# Altium schematic sheet Sch_Dr_LC .SchDoc
size A4; Organization: Altium Limited; Address1: L3, 12a Rodborough Rd; Address2: Frenchs Forest; Address3: NSW; Address4: Australia 2086
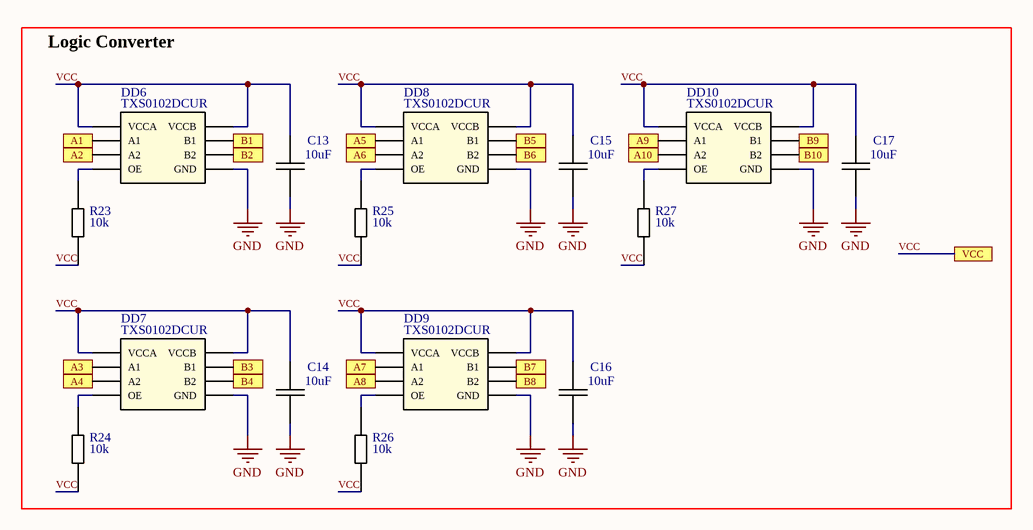
[diagram p0: Sch_Dr_LC .SchDoc]

## Parts
C13  10uF  [Cap_0603]
C14  10uF  [Cap_0603]
C15  10uF  [Cap_0603]
C16  10uF  [Cap_0603]
C17  10uF  [Cap_0603]
DD6  TXS0102DCUR  [VSSOP-8]
DD7  TXS0102DCUR  [VSSOP-8]
DD8  TXS0102DCUR  [VSSOP-8]
DD9  TXS0102DCUR  [VSSOP-8]
DD10  TXS0102DCUR  [VSSOP-8]
R23  10k  [Res_0603]
R24  10k  [Res_0603]
R25  10k  [Res_0603]
R26  10k  [Res_0603]
R27  10k  [Res_0603]

## Blocks framed on the sheet
Logic Converter: C13-C17 DD6-DD10 R23-R27

## Ports
A1, A2, A3, A4, A5, A6, A7, A8, A9, A10, B1, B2, B3, B4, B5, B6, B7, B8, B9, B10, VCC

## Nets
GND: C13.1 C14.1 C15.1 C16.1 C17.1 DD6.2(GND) DD7.2(GND) DD8.2(GND) DD9.2(GND) DD10.2(GND)
A1: DD6.5(A1) ; port A1
A2: DD6.4(A2) ; port A2
A3: DD7.5(A1) ; port A3
A4: DD7.4(A2) ; port A4
A5: DD8.5(A1) ; port A5
A6: DD8.4(A2) ; port A6
A7: DD9.5(A1) ; port A7
A8: DD9.4(A2) ; port A8
A9: DD10.5(A1) ; port A9
A10: DD10.4(A2) ; port A10
B1: DD6.8(B1) ; port B1
B2: DD6.1(B2) ; port B2
B3: DD7.8(B1) ; port B3
B4: DD7.1(B2) ; port B4
B5: DD8.8(B1) ; port B5
B6: DD8.1(B2) ; port B6
B7: DD9.8(B1) ; port B7
B8: DD9.1(B2) ; port B8
B9: DD10.8(B1) ; port B9
B10: DD10.1(B2) ; port B10
VCC: C13.2 C14.2 C15.2 C16.2 C17.2 DD6.3(VCCA) DD6.7(VCCB) DD7.3(VCCA) DD7.7(VCCB) DD8.3(VCCA) DD8.7(VCCB) DD9.3(VCCA) DD9.7(VCCB) DD10.3(VCCA) DD10.7(VCCB) R23.2 R24.2 R25.2 R26.2 R27.2 ; port VCC
NetDD6_6: DD6.6(OE) R23.1
NetDD7_6: DD7.6(OE) R24.1
NetDD8_6: DD8.6(OE) R25.1
NetDD9_6: DD9.6(OE) R26.1
NetDD10_6: DD10.6(OE) R27.1

## Notes on the sheet
- Title
- Size:
- Date:
- A4
- Number:
- Time:
- Revision:
- Sheet
- of
- File:

## Library data of the parts
C13-C17 = Cap_: CC0603KRX5R7BB106
DD6-DD10 = TXS0102YZ: 2-bit Bidirectional Voltage-level Translator for Open-Drain and Push-Pull Application
R23-R27 = Res_: CR-03FL7---10K